# EAGLE design 1U_Mini_BusBoard (EAGLE 7.7.0)
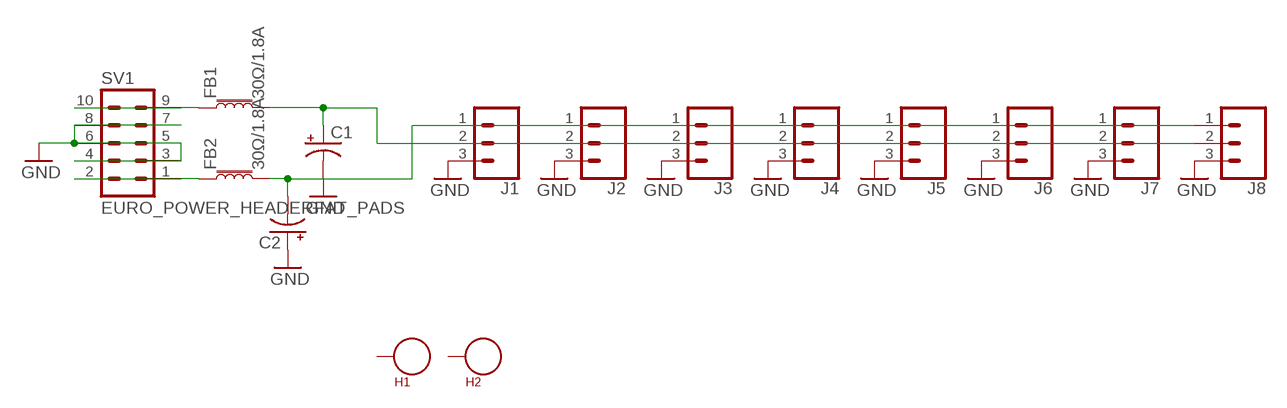
[diagram p0: schematic, sheet 1]

## Parts
C1  CPOL-USC  [PANASONIC_C]
C2  CPOL-USC  [PANASONIC_C]
FB1  30Ω/1.8A  FERRITE_BEAD-0603  [0603]
FB2  30Ω/1.8A  FERRITE_BEAD-0603  [0603]
H1  SEW_HOLE  [SIMPLE_HOLE]
H2  SEW_HOLE  [SIMPLE_HOLE]
J1  CONN_031X03_NO_SILK  [1X03_NO_SILK]
J2  CONN_031X03_NO_SILK  [1X03_NO_SILK]
J3  CONN_031X03_NO_SILK  [1X03_NO_SILK]
J4  CONN_031X03_NO_SILK  [1X03_NO_SILK]
J5  CONN_031X03_NO_SILK  [1X03_NO_SILK]
J6  CONN_031X03_NO_SILK  [1X03_NO_SILK]
J7  CONN_031X03_NO_SILK  [1X03_NO_SILK]
J8  CONN_031X03_NO_SILK  [1X03_NO_SILK]
SV1  EURO_POWER_HEADERFAT_PADS  [EURO_PWR_HEADER_FAT]

## Nets
GND: C1.- C2.+ J1.3 J2.3 J3.3 J4.3 J5.3 J6.3 J7.3 J8.3 SV1.3 SV1.4 SV1.5 SV1.6 SV1.7 SV1.8
N$1: FB1.1 SV1.9 SV1.10
N$2: FB2.1 SV1.1 SV1.2
N$4: C1.+ FB1.2 J1.2 J2.2 J3.2 J4.2 J5.2 J6.2 J7.2 J8.2
N$5: C2.- FB2.2 J1.1 J2.1 J3.1 J4.1 J5.1 J6.1 J7.1 J8.1
Unconnected: H1.P$1 H2.P$1

## Library data of the parts
C1 C2 = adafruit:CPOL-US: POLARIZED CAPACITOR, American symbol
FB1 FB2 = SparkFun-Coils:FERRITE_BEAD: Ferrite Bead (blocks, cores, rings, chokes, etc.) Inductor with layers of ferrite used to suppress high frequencies. Often used to isolate high frequency noise. SparkFun Products: IOIO-OTG - V2.2 <https://www.sparkfun.com/products/13613> SparkFun SAMD21 Mini Breakout <https://www.sparkfun.com/products/13664> SparkFun 6 Degrees of Freedom Breakout - LSM6DS3 <https://www.sparkfun.com/products/13339> SparkFun SAMD21 Dev Breakout <https://www.sparkfun.com/products/13672>; PROD_ID: NDUC-07859
H1 H2 = LilyPad-Wearables:SEW_HOLE: Simple sew-hole .1" diameter hole with 20mil annular ring
J1-J8 = SparkFun-Connectors:CONN_03: Multi connection point. Often used as Generic Header-pin footprint for 0.1 inch spaced/style header connections On any of the 0.1 inch spaced packages, you can populate with these: Break Away Headers - Straight <https://www.sparkfun.com/products/116> (PRT-00116) Break Away Male Headers - Right Angle <https://www.sparkfun.com/products/553> (PRT-00553) Female Headers <https://www.sparkfun.com/products/115> (PRT-00115) Break Away Headers - Machine Pin <https://www.sparkfun.com/products/117> (PRT-00117) Break Away Female Headers - Swiss Machine Pin <https://www.sparkfun.com/products/743> (PRT-00743) Stackable Header - 3 Pin (Female, 0.1") <https://www.sparkfun.com/products/13875> (PRT-13875) For SCREWTERMINALS and SPRING TERMINALS visit here: Screw Terimnals on SparkFun.com <https://www.sparkfun.com/search/results?term=Screw+Terminals> (5mm/3.5mm/2.54mm spacing) This device is also useful as a general connection point to wire up your design to another part of your project. Our various solder wires solder well into these plated through hole pads. Hook-Up Wire - Assortment (Stranded, 22 AWG) <https://www.sparkfun.com/products/11375> (PRT-11375) Hook-Up Wire - Assortment (Solid Core, 22 AWG) <https://www.sparkfun.com/products/11367> (PRT-11367) View the entire wire category on our website here <https://www.sparkfun.com/categories/141> Special notes: Molex polarized connector foot print use with SKU : PRT-08232 with associated crimp pins and housings.
SV1 = MusicThingModular:EURO_POWER_HEADER: Power Header 10 pin power header for Eurorack Power Supplies Variants with fatter pads for easier soldering, and the LOCK variant which has 5mil offset pins to hold the component in place before soldering

## Board
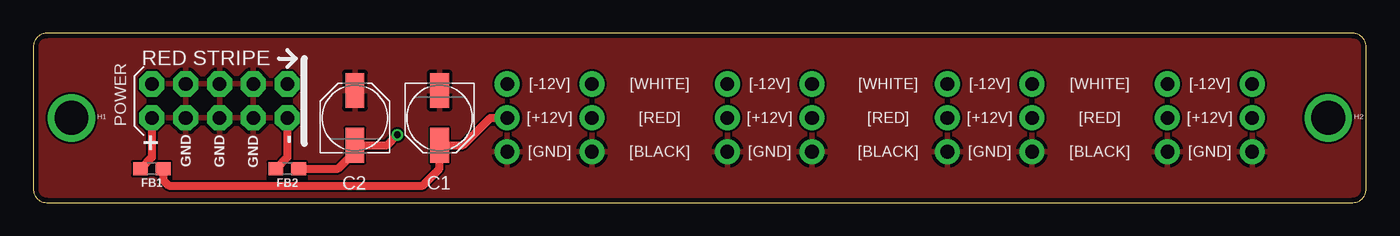
[diagram p1: board, top side]
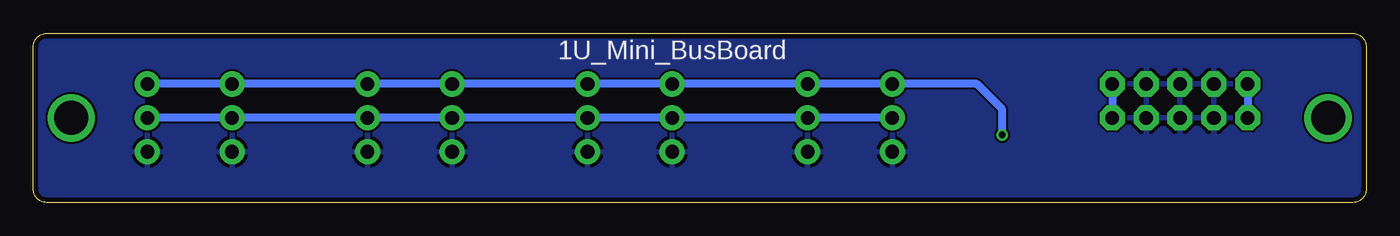
[diagram p2: board, bottom side, seen from below]

Size 100 x 12.69 mm. Coordinates in mm from the lower left corner, seen from the top.
Outline: 0,11.69 0,1 arc90 1,0 99,0 arc90 100,1 100,11.69 arc90 99,12.69 1,12.69 arc90 0,11.69
Copper layers (1*16): Top 0.0356mm / dielectric 1.5011mm / Bottom 0.0356mm
Design rules "PCBs_io": minimum track width 6mil, minimum drill 13mil, track to track 6mil, track to pad 6mil, pad to pad 6mil, via to via 6mil, smd to smd 6mil, copper to edge 15mil, drill to drill 6mil, minimum pad ring 7mil, minimum via ring 7mil, stop-mask expansion 3mil, vias tented up to drill 0mil, thermal gap 10mil

### Footprints (pad centres in the part's own frame; a part is rotated, then mirrored left to right if it is on the bottom)
PANASONIC_C = smd 2.6 x 1.4: + 2.05,0; - -2.05,0
0603 = smd 1.1 x 1: 1 -0.85,0; 2 0.85,0
SIMPLE_HOLE = drill 2.54 pad 3.048: P$1 0,0
1X03_NO_SILK = drill 1.016 pad 1.88: 1 0,0; 2 2.54,0; 3 5.08,0
EURO_PWR_HEADER_FAT = drill 1.016 pad 1.88 octagon: 1 -5.08,-1.27; 2 -5.08,1.27; 3 -2.54,-1.27; 4 -2.54,1.27; 5 0,-1.27; 6 0,1.27; 7 2.54,-1.27; 8 2.54,1.27; 9 5.08,-1.27; 10 5.08,1.27

### Placement (x,y rotation side)
C1  30.48,6.35 270 top
C2  24.13,6.35 90 top
FB1  8.89,2.54 0 top
FB2  19.05,2.54 0 top
H1  2.86,6.35 0 top
H2  97.16,6.35 0 top
J1  35.56,8.89 270 top
J2  41.91,8.89 270 top
J3  52.07,8.89 270 top
J4  58.42,8.89 270 top
J5  68.58,8.89 270 top
J6  74.93,8.89 270 top
J7  85.09,8.89 270 top
J8  91.44,8.89 270 top
SV1  13.97,7.62 180 top

### Tracks (layer width: path | path; a pad name or v marks a point on that pad's centre or on a via)
GND
  pour Bottom: 0,13.97 100.33,13.97 100.33,-1.27 0,-1.27
  pour Top: 0,13.97 100.33,13.97 100.33,-1.27 0,-1.27
N$1
  Top 0.61: SV1.10 8.89,3.39 FB1.1
  Bottom 0.61: SV1.9 SV1.10
N$2
  Top 0.61: SV1.2 19.05,3.39 FB2.1
  Bottom 0.61: SV1.1 SV1.2
N$4
  Top 0.61: J1.2 34.29,6.35 32.24,4.3 C1.+ 30.48,2.54 29.21,1.27 10.16,1.27 9.74,1.69 FB1.2
  Bottom 0.61: J1.2 J2.2 J3.2 J4.2 J5.2 J6.2 J7.2 J8.2
N$5  (via drill 0.5)
  Top 0.61: FB2.2 22.86,2.54 24.13,3.81 C2.- 26.52,4.3 v27.3,5.08
  Bottom 0.61: J8.1 J7.1 J6.1 J5.1 J4.1 J3.1 J2.1 J1.1 29.21,8.89 27.3,6.99 v27.3,5.08

### Text on the board
tPlace: [-12V] | [WHITE] | [-12V] | [WHITE] | [-12V] | [WHITE] | [-12V] | [+12V] | [RED] | [+12V] | [RED] | [+12V] | [RED] | [+12V] | [GND] | [BLACK] | [GND] | [BLACK] | [GND] | [BLACK] | [GND]
bPlace: 1U_Mini_BusBoard